# Altium project wikidunio-rda5981.PrjPCB
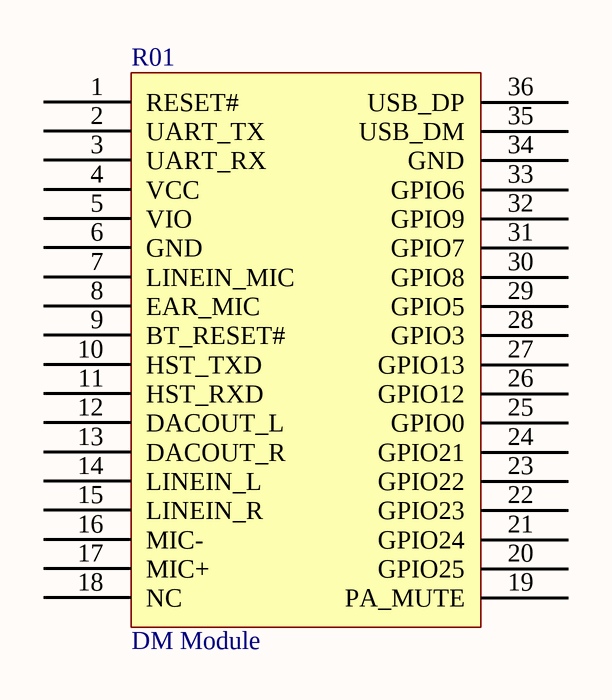
[diagram p0: bytetd-r01.SchDoc]
1 sheet, 1 parts. Net scope: global (net labels, ports and power ports of the same name join across sheets).
Board file: wikidunio-rda5981.PcbDoc

## Sheet bytetd-r01.SchDoc
size A4

### Parts
R01  DM Module  [R01]

### Nets

Not connected (* = marked no-connect by the designer): R01 1(RESET#) 2(UART_TX) 3(UART_RX) 4(VCC) 5(VIO) 6(GND) 7(LINEIN_MIC) 8(EAR_MIC) 9(BT_RESET#) 10(HST_TXD) 11(HST_RXD) 12(DACOUT_L) 13(DACOUT_R) 14(LINEIN_L) 15(LINEIN_R) 16(MIC-) 17(MIC+) 18(NC) 19(PA_MUTE) 20(GPIO25) 21(GPIO24) 22(GPIO23) 23(GPIO22) 24(GPIO21) 25(GPIO0) 26(GPIO12) 27(GPIO13) 28(GPIO3) 29(GPIO5) 30(GPIO8) 31(GPIO7) 32(GPIO9) 33(GPIO6) 34(GND) 35(USB_DM) 36(USB_DP)

### Library data of the parts
R01 = R01: Wi-Fi BT Module